# EasyEDA Pro project LidarAdaptor_250813A.epro

# Schematic CH340K转TTL
Board Name: CH340K转TTL; Create Date: 2025-08-02; Page Name: Sheet_1; Project Name: SCH_CH340K转TTL_2025-08-02; Schematic Name: CH340K转TTL; Update Date: 2025-08-02; Add into BOM: yes; Company: Your Company; Convert to PCB: yes; Date: 2021-09-27; Draw By: xiaosheng0707; REV: 1.0; Sheet: 1/1; spicePre: .
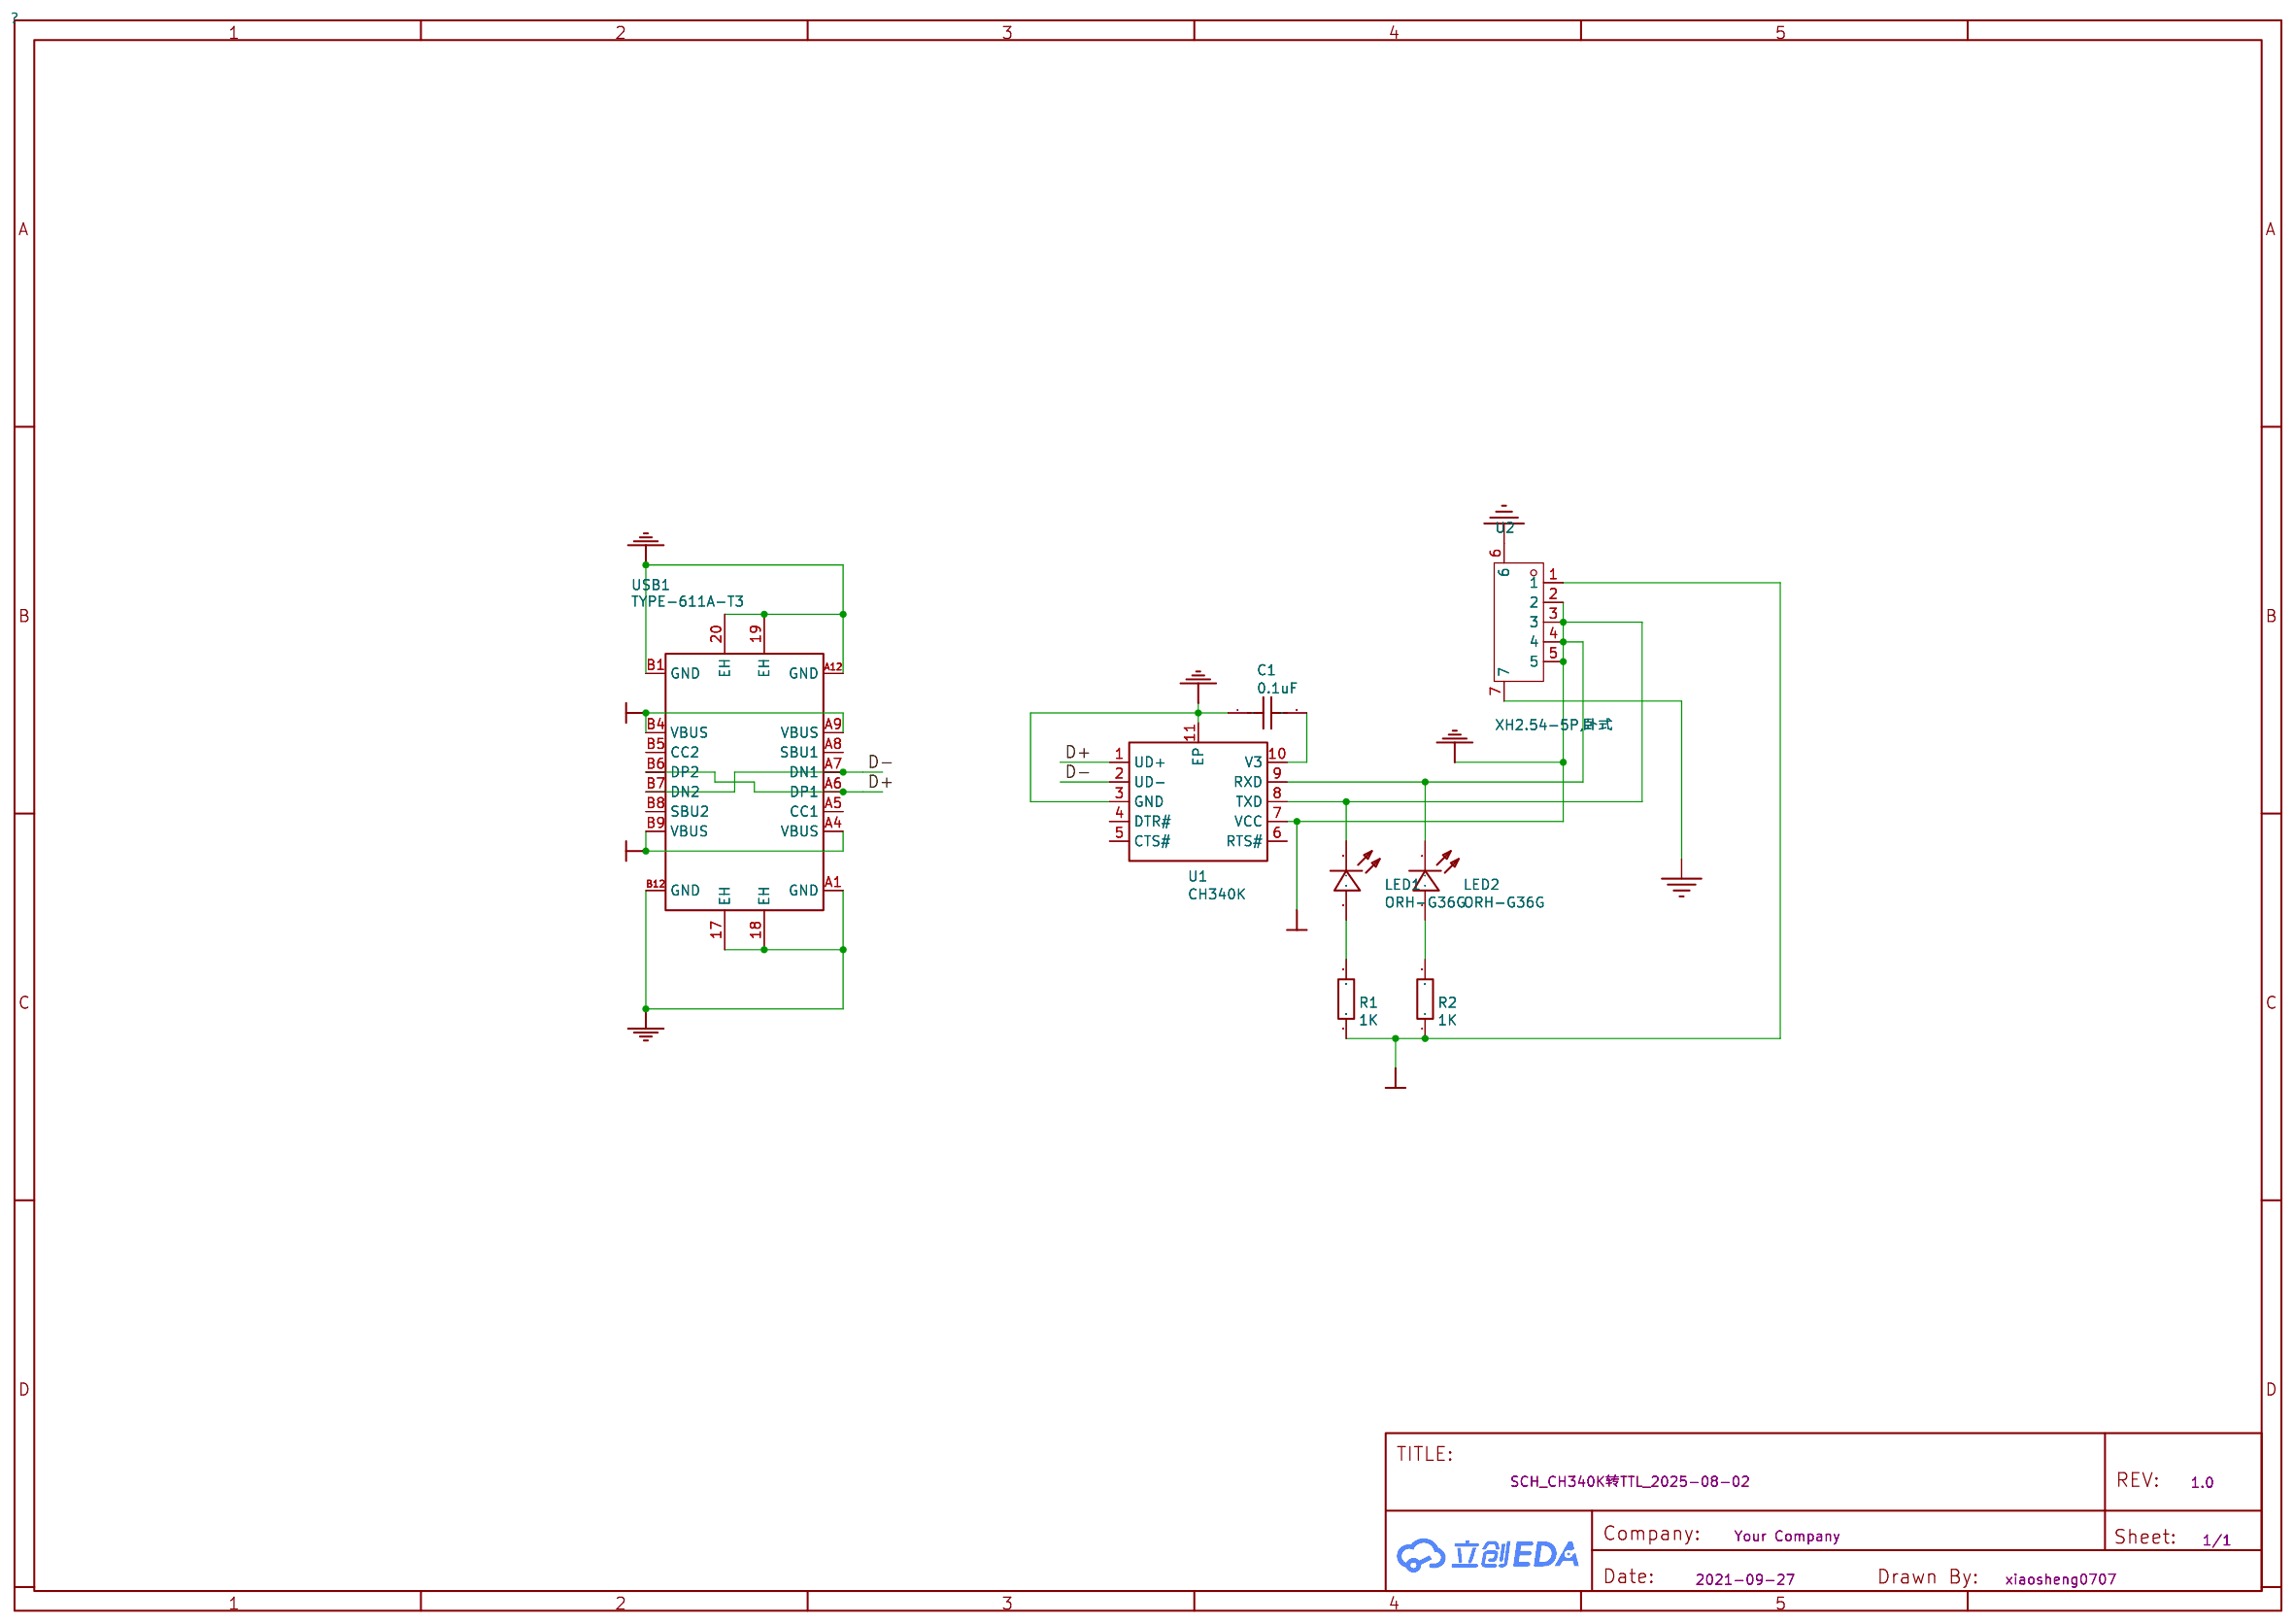
[diagram p0: schematic sheet]

## Parts
C1  0.1uF
LED1  ORH-G36G
LED2  ORH-G36G
R1  1K
R2  1K
U1  CH340K
U2  XH2.54-5P,卧式  [CONN-SMD_5P-P2.50_XUNPU_WAFER-254W-5P]
USB1  TYPE-611A-T3

## Library data of the parts
C1 = 0.1uF: Supplier: LCSC; Supplier Part: C2317177; Manufacturer: VISHAY(威世); Manufacturer Part: VJ0805D151MXPAT; nameAlias: Capacitance; Contributor: LCSC; spicePre: C; spiceSymbolName: VJ0805D151MXPAT
LED1 LED2 = ORH-G36G: Supplier: LCSC; Supplier Part: C205443; Manufacturer: Orient; JLCPCB Part Class: Extended Part; Contributor: LCSC; spicePre: L
R1 R2 = 1K: Supplier: LCSC; Manufacturer: FH; Manufacturer Part: RS-03K1001FT; Supplier Part: C115325; JLCPCB Part Class: Extended Part; nameAlias: Resistance (Ohms); spicePre: R; spiceSymbolName: RS-03K1001FT
U1 = CH340K: Supplier: LCSC; Supplier Part: C968586; Manufacturer: WCH(Jiangsu Qin Heng); JLCPCB Part Class: Extended Part; Contributor: LCSC; spicePre: U
U2 = XH2.54-5P,卧式: Supplier Part: C9900019986; Supplier Footprint: CONN-SMD_5P-P2.50; JLCPCB Part Class: Extended Part; Supplier: LCSC
USB1 = TYPE-611A-T3: Supplier: LCSC; Supplier Part: C2689845; Manufacturer: Yuandi(台湾元迪); JLCPCB Part Class: Extended Part; Contributor: LCSC; spicePre: U; Package Display: No

## Nets
GND: C1.1 LED1.2(K) LED2.2(K) U1.3(GND) U1.7(VCC) U1.8(TXD) U1.9(RXD) U1.11(EP) U2.2 U2.3 U2.4 U2.5 U2.6 U2.7 USB1.17(EH) USB1.18(EH) USB1.19(EH) USB1.20(EH) USB1.A1(GND) USB1.A12(GND) USB1.B1(GND) USB1.B12(GND)
VCC: R1.1 R2.1 U2.1 USB1.A4(VBUS) USB1.A9(VBUS) USB1.B4(VBUS) USB1.B9(VBUS)
D+: U1.1(UD+) USB1.A6(DP1) USB1.B6(DP2)
D-: U1.2(UD-) USB1.A7(DN1) USB1.B7(DN2)
R1_2: LED1.1(A) R1.2
R2_2: LED2.1(A) R2.2
U1_10: C1.2 U1.10(V3)

Not connected (* = marked no-connect by the designer): U1 4(DTR#) 5(CTS#) 6(RTS#); USB1 A5(CC1) A8(SBU1) B5(CC2) B8(SBU2)

# Board PCB2
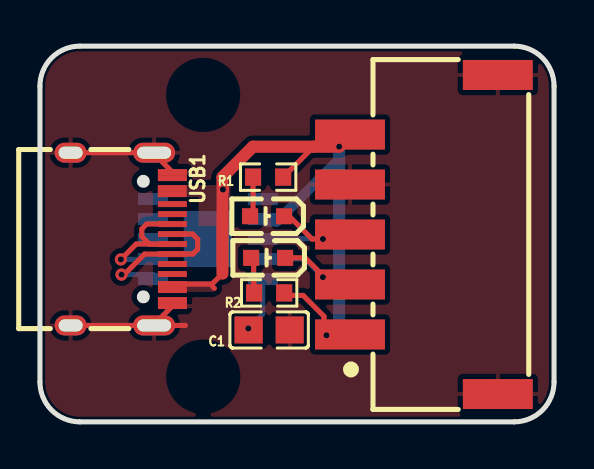
[diagram p1: board, top side]
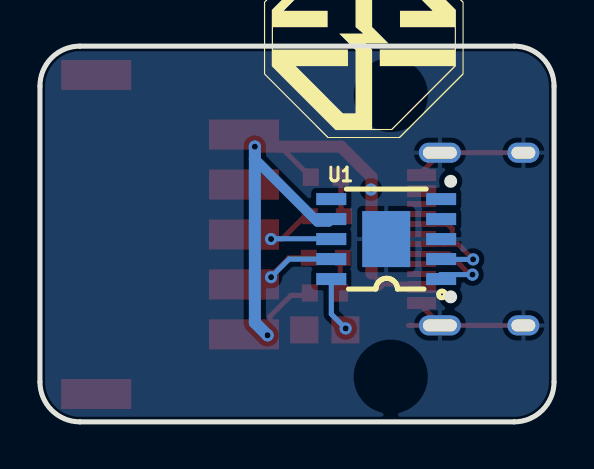
[diagram p2: board, bottom side, seen from below]

Outline 25.74 x 18.8 mm; copper layers: Top Layer, Bottom Layer. Coordinates in mm from the lower left corner of the outline.
Outline path: 0,16.8 0,2 arc(0.59,0.59) 2,0 23.74,0 arc(25.15,0.59) 25.74,2 25.74,16.8 arc(25.15,18.21) 23.74,18.8 2,18.8 arc(0.59,18.21) 0,16.8
Stack: Top Layer 0.035mm / Dielectric1 1.51mm FR4 er 4.5 / Bottom Layer 0.035mm

## Design rules (mm)
template: JLCPCB Capability(Two Layers Board)
spacing copperThickness1oz (default): track to track 0.102, other pairs 0.152 to 0.3
spacing copperThickness2oz: track to track 0.203, other pairs 0.152 to 0.3
track width copperThickness1oz (default): min 0.127, default 0.254, max 2.54
track width copperThickness2oz: min 0.203, default 0.254, max 2.54
differential pair differentialPair (default): width min 0.127, default 0.254, max 2.54; gap min 0.152, default 0.152
via viaSize (default): diameter min 0.5, default 0.61, max 10; hole min 0.3, default 0.305, max 6.3

## Placement (name value [footprint] x y rotation side)
C1  0.1uF  [C0805]  11.47 4.6 180 top
LED1  ORH-G36G  [LED0603-R-RD]  11.37 10.29 180 top
LED2  ORH-G36G  [LED0603-R-RD]  11.42 8.2 180 top
R1  1K  [R0603]  11.42 12.24 180 top
R2  1K  [R0603]  11.47 6.45 180 top
U1  CH340K  [CONN-SMD_5P-P2.50_XUNPU_WAFER-254W-5P]  19.22 9.37 90 top
U1#2  -  [ESOP-10_L4.9-W3.9-P1.00-LS6.2-BL-EP]  8.4 9.14 90 bottom
USB1  TYPE-611A-T3  [USB-C-SMD_TYPE-611A-T3]  4.08 9.14 270 top

## Footprints (pads in the part's own frame, mm; a bottom-side part is the same pattern mirrored in y, then rotated)
C0805
  rect 1.41x1.35 smd: 1(-1.03,0) 2(1.03,0)
CONN-SMD_5P-P2.50_XUNPU_WAFER-254W-5P
  rect 1.5x3.5 smd: 1(-5,3.7) 2(-2.5,3.7) 3(0,3.7) 4(2.5,3.7) 5(5,3.7) 6(-7.98,-3.7) 7(7.98,-3.7)
ESOP-10_L4.9-W3.9-P1.00-LS6.2-BL-EP
  rect 0.6x1.5 smd: 1(-2.001,-2.75) 2(-1,-2.75) 3(-0.001,-2.75) 4(1,-2.75) 5(2,-2.75) 6(2,2.75) 7(1,2.75) 8(-0.001,2.75) 9(-1,2.75) 10(-2.001,2.75)
  rect 2.8x2.4 smd: 11(-0.001,0)
LED0603-R-RD
  rect 0.8x0.8 smd: 1(0.851,0) 2(-0.851,0)
R0603
  rect 0.806x0.864 smd: 1(-0.753,0) 2(0.753,0)
USB-C-SMD_TYPE-611A-T3
  oval 1x2.1 hole 0.6x1.7: 17(4.32,1.633) 20(-4.32,1.633)
  oval 1x1.6 hole 0.6x1.2: 18(4.32,-2.547) 19(-4.32,-2.547)
  rect 0.3x1.45 smd: A1(-3.35,2.546) A4(-2.55,2.543) A5(-1.25,2.547) A6(-0.25,2.547) A7(0.25,2.546) A8(1.25,2.547) A9(2.55,2.547) A12(3.35,2.547) B1(3.05,2.547) B4(2.25,2.547) B5(1.75,2.547) B6(0.75,2.547) B7(-0.75,2.546) B8(-1.75,2.547) B9(-2.25,2.543) B12(-3.05,2.546)

## Nets
GND: C1.1 U1.4 U1.6 U1.7 U1#2.3 U1#2.11 USB1.17 USB1.18 USB1.19 USB1.20 USB1.A1 USB1.A12 USB1.B1 USB1.B12
VCC: R1.1 R2.1 U1.1 U1.5 U1#2.7 USB1.A4 USB1.A9 USB1.B4 USB1.B9
D+: U1#2.1 USB1.A6 USB1.B6
D-: U1#2.2 USB1.A7 USB1.B7
R1_2: LED1.1 R1.2
R2_2: LED2.1 R2.2
U1_4: U1#2.4
U1_5: U1#2.5
U1_6: U1#2.6
U1_8: LED1.2 U1.3 U1#2.8
U1_9: LED2.2 U1.2 U1#2.9
U1_10: C1.2 U1#2.10
USB1_A5: USB1.A5
USB1_A8: USB1.A8
USB1_B5: USB1.B5
USB1_B8: USB1.B8

## Via types
v1: diameter 0.61, hole 0.305, Top Layer to Bottom Layer, 8 vias

## Routing (per net, layer and track width the routed paths; a pad name or vN(x,y) marks a point on that pad's centre or on a via; arc(x,y) is an arc through that point)
GND: length 12.6
  Top Layer w0.254: USB1.18 USB1.17 5.72,4.88 USB1.A12 ; 5.72,4.82 7.28,4.82 ; USB1.19 USB1.20 5.72,13.41 USB1.A1
VCC: length 36.8
  Top Layer w0.254: 6.63,6.59 USB1.B4 8.62,6.89 9.14,7.42 ; 12.23,6.32 13.18,6.32 14.22,5.28 14.22,4.33 ; R1.1 13.7,13.77 ; 8.73,6.68 8.63,6.78
  Top Layer w0.6: v1(14.98,13.77) 10.66,13.77 9.14,12.24 9.14,7.42 ; v1(14.34,4.33) 16.24,4.33
  Bottom Layer w0.5: U1#2.7 11.28,10.02 11.85,10.02 14.98,13.15
  Bottom Layer w0.6: v1(14.34,4.33) 14.98,4.97 v1(14.98,13.77)
  vias: v1(9.16,11.62)
D+: length 7.9
  Top Layer w0.254: 6.63,9.39 7.64,9.39 7.89,9.14 7.89,8.64 7.65,8.39 USB1.B6 5.24,8.39 4.21,7.37 v1(4.08,7.37)
  Bottom Layer w0.254: v1(4.08,7.37) 5.68,7.37 5.78,7.27
D-: length 8.4
  Top Layer w0.254: 5.48,8.89 USB1.A7 5.48,8.89 ; 5.48,8.89 4.82,8.89 v1(4.05,8.13) ; 5.48,8.89 5.1,9.27 5.1,9.65 5.34,9.89 USB1.B7
  Bottom Layer w0.254: v1(4.05,8.13) 5.64,8.13 5.78,8.27
R1_2: length 2
  Top Layer w0.254: R1.2 10.67,10.44 LED1.1
R2_2: length 1.8
  Top Layer w0.254: 10.63,6.2 10.7,6.27 10.7,7.95
U1_8: length 5.2
  Top Layer w0.254: 12.48,10.29 13.62,9.14 v1(14.17,9.14)
  Bottom Layer w0.254: v1(14.17,9.14) 14.15,9.16 11.17,9.16 U1#2.8
U1_9: length 5.7
  Top Layer w0.254: v1(14.17,7.24) 14.17,7.32 13.28,8.2 12.66,8.2 12.4,7.95
  Bottom Layer w0.254: v1(14.17,7.24) 13.26,8.14 U1#2.9
U1_10: length 2.8
  Bottom Layer w0.254: v1(10.43,4.67) 11.15,5.39 U1#2.10

## Copper pours and planes (outline as drawn; the poured copper is in the pictures)
GND on Top Layer: 0.2,16.8 0.22,17.08 0.28,17.36 0.38,17.63 0.52,17.88 0.69,18.11 0.89,18.31 1.12,18.48 1.37,18.62 1.64,18.71 1.91,18.78 2.2,18.8 23.7,18.8 23.98,18.78 24.26,18.71 24.53,18.62 24.78,18.48 25.01,18.31 25.21,18.11 25.38,17.88 25.52,17.63 25.62,17.36 25.68,17.08 25.7,16.8 25.7,2.1 25.68,1.82 25.62,1.54 25.52,1.27 25.38,1.02 25.21,0.79 25.01,0.59 24.78,0.42 24.53,0.28 24.26,0.18 23.98,0.12 23.7,0.1 2.2,0.1 1.91,0.12 1.64,0.18 1.37,0.28 1.12,0.42 0.89,0.59 0.69,0.79 0.52,1.02 0.38,1.27 0.28,1.54 0.22,1.82 0.2,2.1
GND on Bottom Layer: 0.08,16.77 0.1,17.06 0.17,17.33 0.26,17.6 0.4,17.85 0.57,18.08 0.77,18.28 1,18.45 1.25,18.59 1.52,18.69 1.8,18.75 2.08,18.77 23.58,18.77 23.87,18.75 24.15,18.69 24.41,18.59 24.67,18.45 24.89,18.28 25.1,18.08 25.27,17.85 25.4,17.6 25.5,17.33 25.56,17.06 25.58,16.77 25.58,2.08 25.56,1.79 25.5,1.51 25.4,1.25 25.27,0.99 25.1,0.77 24.89,0.56 24.67,0.39 24.41,0.26 24.15,0.16 23.87,0.1 23.58,0.08 2.08,0.08 1.8,0.1 1.52,0.16 1.25,0.26 1,0.39 0.77,0.56 0.57,0.77 0.4,0.99 0.26,1.25 0.17,1.51 0.1,1.79 0.08,2.08
VCC on Top Layer: 5.91,11.85 9.54,11.85 9.54,9.79 5.91,9.79
VCC on Top Layer: 5.91,7.03 8.75,7.03 8.75,6.5 5.91,6.5

# Board PCB3
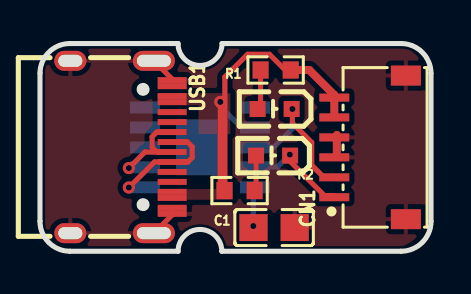
[diagram p3: board, top side]
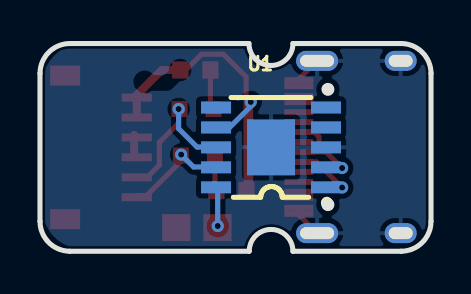
[diagram p4: board, bottom side, seen from below]

Outline 19.56 x 10.41 mm; copper layers: Top Layer, Bottom Layer. Coordinates in mm from the lower left corner of the outline.
Outline path: 0,8.91 arc(0.44,9.97) 1.5,10.41 6.91,10.41 arc(7.23,9.64) 8.01,9.31 arc(8.78,9.64) 9.11,10.41 18.06,10.41 arc(19.12,9.97) 19.56,8.91 19.56,1.5 arc(19.12,0.44) 18.06,0 9.09,0 arc(8,1.09) 6.91,0 1.5,0 arc(0.44,0.44) 0,1.5 0,8.91
Stack: Top Layer 0.035mm / Dielectric1 1.51mm FR4 er 4.5 / Bottom Layer 0.035mm

## Design rules (mm)
template: JLCPCB Capability(Two Layers Board)
spacing copperThickness1oz (default): track to track 0.102, other pairs 0.152 to 0.3
spacing copperThickness2oz: track to track 0.203, other pairs 0.152 to 0.3
track width copperThickness1oz (default): min 0.127, default 0.254, max 2.54
track width copperThickness2oz: min 0.203, default 0.254, max 2.54
differential pair differentialPair (default): width min 0.127, default 0.254, max 2.54; gap min 0.152, default 0.152
via viaSize (default): diameter min 0.5, default 0.61, max 10; hole min 0.3, default 0.305, max 6.3

## Placement (name value [footprint] x y rotation side)
C1  150pF  [C0805]  11.71 1.19 180 top
CN1  SH1.0-6P  [CONN-SMD_6P-P1.00-H-M_AFC10-S06QCC-00]  16.51 5.21 90 top
LED1  ORH-G36G  [LED0603-R-RD]  11.73 7.13 180 top
LED2  ORH-G36G  [LED0603-R-RD]  11.66 4.79 180 top
R1  1kΩ  [R0603]  11.79 9.09 180 top
R2  1kΩ  [R0603]  9.98 3.04 0 top
U1  CH340K  [ESOP-10_L4.9-W3.9-P1.00-LS6.2-BL-EP]  8 5.21 90 bottom
USB1  TYPE-611A-T3  [USB-C-SMD_TYPE-611A-T3]  4.06 5.23 270 top

## Footprints (pads in the part's own frame, mm; a bottom-side part is the same pattern mirrored in y, then rotated)
C0805
  rect 1.41x1.35 smd: 1(-1.03,0) 2(1.03,0)
CONN-SMD_6P-P1.00-H-M_AFC10-S06QCC-00
  rect 0.4x1.5 smd: 1(-2.5,1.79) 2(-1.5,1.79) 3(-0.5,1.79) 4(0.5,1.79) 5(1.5,1.79) 6(2.5,1.79)
  rect 1x1.5 smd: 7(3.6,-1.79) 8(-3.6,-1.79)
ESOP-10_L4.9-W3.9-P1.00-LS6.2-BL-EP
  rect 0.6x1.5 smd: 1(-2.001,-2.75) 2(-1,-2.75) 3(-0.001,-2.75) 4(1,-2.75) 5(2,-2.75) 6(2,2.75) 7(1,2.75) 8(-0.001,2.75) 9(-1,2.75) 10(-2.001,2.75)
  rect 2.8x2.4 smd: 11(-0.001,0)
LED0603-R-RD
  rect 0.8x0.8 smd: 1(0.851,0) 2(-0.851,0)
R0603
  rect 0.806x0.864 smd: 1(-0.753,0) 2(0.753,0)
USB-C-SMD_TYPE-611A-T3
  oval 1x2.1 hole 0.6x1.7: 17(4.32,1.633) 20(-4.32,1.633)
  oval 1x1.6 hole 0.6x1.2: 18(4.32,-2.547) 19(-4.32,-2.547)
  rect 0.3x1.45 smd: A1(-3.35,2.546) A4(-2.55,2.543) A5(-1.25,2.547) A6(-0.25,2.547) A7(0.25,2.546) A8(1.25,2.547) A9(2.55,2.547) A12(3.35,2.547) B1(3.05,2.547) B4(2.25,2.547) B5(1.75,2.547) B6(0.75,2.547) B7(-0.75,2.546) B8(-1.75,2.547) B9(-2.25,2.543) B12(-3.05,2.546)

## Nets
GND: C1.1 CN1.3 CN1.4 CN1.7 CN1.8 U1.3 U1.11 USB1.17 USB1.18 USB1.19 USB1.20 USB1.A1 USB1.A12 USB1.B1 USB1.B12
VCC: CN1.5 CN1.6 R1.1 R2.1 U1.7 USB1.A4 USB1.A9 USB1.B4 USB1.B9
D+: U1.1 USB1.A6 USB1.B6
D-: U1.2 USB1.A7 USB1.B7
R1_2: LED1.1 R1.2
R2_2: LED2.1 R2.2
U1_4: U1.4
U1_5: U1.5
U1_6: U1.6
U1_8: CN1.2 LED1.2 U1.8
U1_9: CN1.1 LED2.2 U1.9
U1_10: C1.2 U1.10
USB1_A5: USB1.A5
USB1_A8: USB1.A8
USB1_B5: USB1.B5
USB1_B8: USB1.B8

## Via types
v1: diameter 0.61, hole 0.305, Top Layer to Bottom Layer, 6 vias

## Routing (per net, layer and track width the routed paths; a pad name or vN(x,y) marks a point on that pad's centre or on a via; arc(x,y) is an arc through that point)
GND: length 4
  Top Layer w0.254: USB1.17 6.61,1.82 USB1.B1 ; USB1.20 6.61,8.63 USB1.A1
  Top Layer w0.4: 14.85,5.83 14.85,4.83
VCC: length 19.9
  Top Layer w0.254: R2.1 9.23,3.13 9.02,3.35 v1(9.02,7.49) ; 9.25,3.43 9.25,8.74 10.38,9.87 11.47,9.87 12.26,9.09 R1.1
  Top Layer w0.4: R1.1 13.47,9.09 14.72,7.83 14.72,6.83
  Bottom Layer w0.254: v1(9.02,7.49) 9.02,7.26 10.12,6.16 10.62,6.16
D+: length 5.4
  Top Layer w0.254: v1(4.45,3.19) 5.73,4.48 USB1.B6 7.4,4.48 7.61,4.69 7.61,5.24 7.38,5.48 USB1.A6
D-: length 4.5
  Top Layer w0.254: 5.84,4.98 5.25,4.98 v1(4.45,4.17) ; 5.84,4.98 5.61,5.21 5.61,5.74 5.84,5.98 USB1.B7 ; 5.84,4.98 USB1.A7
R1_2: length 2
  Top Layer w0.254: R1.2 11.03,7.28 LED1.1
R2_2: length 1.8
  Top Layer w0.254: LED2.1 10.81,3.11 R2.2
U1_8: length 8
  Top Layer w0.254: LED1.2 v1(12.62,7.13) 12.62,6.43 13.59,5.46 13.59,4.32 14.2,3.71 CN1.2
  Bottom Layer w0.254: v1(12.62,7.13) 12.62,6.15 11.7,5.23 10.62,5.23
U1_9: length 5.4
  Top Layer w0.254: 14.68,2.79 14.22,2.79 12.51,4.51 12.51,4.83 v1(12.5,4.85)
  Bottom Layer w0.254: v1(12.5,4.85) 11.88,4.23 10.62,4.23
U1_10: length 2
  Bottom Layer w0.254: 10.62,3.23 10.67,3.18 v1(10.67,1.26)

## Copper pours and planes (outline as drawn; the poured copper is in the pictures)
GND on Top Layer: 0,8.4 0.02,8.68 0.08,8.96 0.18,9.23 0.32,9.48 0.49,9.71 0.69,9.91 0.92,10.08 1.17,10.21 1.44,10.31 1.72,10.38 2,10.4 17.43,10.4 17.72,10.38 17.99,10.31 18.26,10.21 18.51,10.08 18.74,9.91 18.94,9.71 19.11,9.48 19.25,9.23 19.35,8.96 19.41,8.68 19.43,8.4 19.43,2.13 19.41,1.84 19.35,1.56 19.25,1.3 19.11,1.05 18.94,0.82 18.74,0.62 18.51,0.44 18.26,0.31 17.99,0.21 17.72,0.15 17.43,0.13 2,0.13 1.72,0.15 1.44,0.21 1.17,0.31 0.92,0.44 0.69,0.62 0.49,0.82 0.32,1.05 0.18,1.3 0.08,1.56 0.02,1.84 0,2.13
GND on Bottom Layer: 0,8.4 0.02,8.68 0.08,8.96 0.18,9.23 0.32,9.48 0.49,9.71 0.69,9.91 0.92,10.08 1.17,10.21 1.44,10.31 1.72,10.38 2,10.4 17.43,10.4 17.72,10.38 17.99,10.31 18.26,10.21 18.51,10.08 18.74,9.91 18.94,9.71 19.11,9.48 19.25,9.23 19.35,8.96 19.41,8.68 19.43,8.4 19.43,2.13 19.41,1.84 19.35,1.56 19.25,1.3 19.11,1.05 18.94,0.82 18.74,0.62 18.51,0.44 18.26,0.31 17.99,0.21 17.72,0.15 17.43,0.13 2,0.13 1.72,0.15 1.44,0.21 1.17,0.31 0.92,0.44 0.69,0.62 0.49,0.82 0.32,1.05 0.18,1.3 0.08,1.56 0.02,1.84 0,2.13
VCC on Top Layer: 5.89,7.93 9.52,7.93 9.52,5.88 5.89,5.88
VCC on Top Layer: 6.74,3.12 9.62,3.12 9.62,2.58 6.74,2.58
